# Altium schematic sheet 05_OVP_OCP.SchDoc
size A4
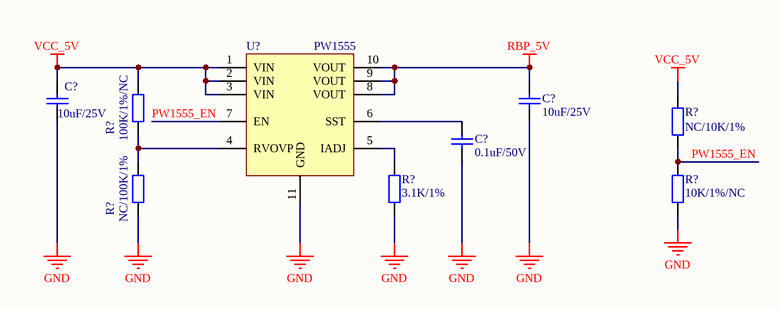
[diagram p0: 05_OVP_OCP.SchDoc]

## Parts
(Parts that share a designator on the sheet are numbered #1, #2 ... from top to bottom, then left to right.)
C?#1  10uF/25V  [C0805_L]
C?#2  10uF/25V  [C0805_L]
C?#3  0.1uF/50V  [C0402_L]
R?#1  100K/1%/NC  [R0402_L]
R?#2  NC/10K/1%  [R0402_L]
R?#3  NC/100K/1%  [R0402_L]
R?#4  3.1K/1%  [R0402_L]
R?#5  10K/1%/NC  [R0402_L]
U?  PW1555  [DFN3x3-10]

## Nets
GND: C?#1.1 C?#2.1 C?#3.1 R?#3.1 R?#4.1 R?#5.1 U?.11(GND)
RBP_5V: C?#2.2 U?.8(VOUT) U?.9(VOUT) U?.10(VOUT)
VCC_5V: C?#1.2 R?#1.2 R?#2.2 U?.1(VIN) U?.2(VIN) U?.3(VIN)
PW1555_EN: R?#2.1 R?#5.2 U?.7(EN)
NetC?#3_2: C?#3.2 U?.6(SST)
NetR?#1_1: R?#1.1 R?#3.2 U?.4(RVOVP)
NetR?#4_2: R?#4.2 U?.5(IADJ)

## Library data of the parts
C?#1-C?#3 = C: 贴片电容; BOM名称: 无极性贴片电容; 联系卖家，免费查找封装: 唯一出售店铺网址https://shop463601444.taobao.com
R?#1-R?#5 = R: 贴片电阻; 联系卖家，免费查找封装: 唯一出售店铺网址https://shop463601444.taobao.com; BOM名称: 贴片电阻
U? = PW1555: VOVP  ILIM保护芯片